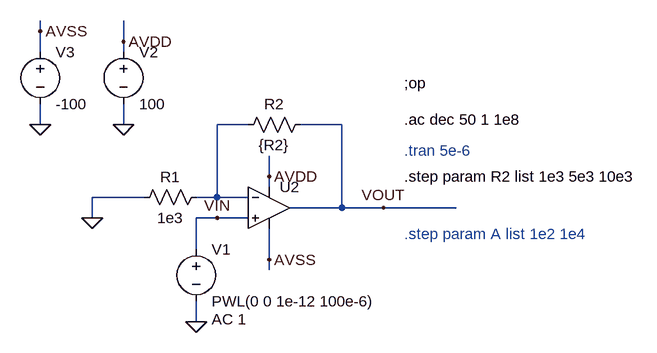
[diagram p0: schematic Opamp1.asc]
Opamp1.asc, the LTspice schematic file:
Version 4
SHEET 1 880 680
WIRE -176 -128 -176 -144
WIRE -48 -112 -48 -144
WIRE -176 -96 -176 -128
WIRE -48 -96 -48 -112
WIRE -176 16 -176 -16
WIRE -48 16 -48 -16
WIRE 144 16 96 16
WIRE 288 16 224 16
WIRE 176 96 176 64
WIRE 176 112 176 96
WIRE -16 128 -96 128
WIRE 96 128 96 16
WIRE 96 128 64 128
WIRE 144 128 96 128
WIRE 288 144 288 16
WIRE 288 144 208 144
WIRE 352 144 288 144
WIRE 464 144 352 144
WIRE -96 160 -96 128
WIRE 96 160 64 160
WIRE 144 160 96 160
WIRE 64 208 64 160
WIRE 176 224 176 176
WIRE 176 240 176 224
WIRE 64 320 64 288
FLAG -48 16 0
FLAG -48 -112 AVDD
FLAG 176 96 AVDD
FLAG -176 16 0
FLAG 176 224 AVSS
FLAG -176 -128 AVSS
FLAG 352 144 VOUT
FLAG -96 160 0
FLAG 64 320 0
FLAG 96 160 VIN
DATAFLAG 176 96 ""
DATAFLAG 80 128 ""
DATAFLAG -64 128 ""
DATAFLAG 256 144 ""
DATAFLAG 176 208 ""
DATAFLAG -176 -128 ""
DATAFLAG -48 -128 ""
SYMBOL OpAmps\\UniversalOpamp2 176 144 R0
SYMATTR InstName U2
SYMATTR Value2 Avol=1e4 GBW=10Meg Slew=10Meg
SYMBOL voltage 64 192 R0
WINDOW 123 24 124 Left 2
WINDOW 39 0 0 Left 0
SYMATTR Value2 AC 1
SYMATTR InstName V1
SYMATTR Value PWL(0 0 1e-12 100e-6)
SYMBOL res 80 112 R90
WINDOW 0 0 56 VBottom 2
WINDOW 3 32 56 VTop 2
SYMATTR InstName R1
SYMATTR Value 1e3
SYMBOL res 240 0 R90
WINDOW 0 0 56 VBottom 2
WINDOW 3 32 56 VTop 2
SYMATTR InstName R2
SYMATTR Value {R2}
SYMBOL voltage -48 -112 R0
WINDOW 123 0 0 Left 0
WINDOW 39 0 0 Left 0
SYMATTR InstName V2
SYMATTR Value 100
SYMBOL voltage -176 -112 R0
WINDOW 123 0 0 Left 0
WINDOW 39 0 0 Left 0
SYMATTR InstName V3
SYMATTR Value -100
TEXT 384 -48 Left 2 !;op
TEXT 384 8 Left 2 !.ac dec 50 1 1e8
TEXT 384 56 Left 2 ;.tran 5e-6
TEXT 384 96 Left 2 !.step param R2 list 1e3 5e3 10e3
TEXT 384 184 Left 2 ;.step param A list 1e2 1e4

The netlist it stands for:
* Opamp1.asc
XU2 VIN N001 AVDD AVSS VOUT level.2 Avol=1e4 GBW=10Meg Slew=10Meg ilimit=25m rail=0 Vos=0 phimargin=45 en=0 enk=0 in=0 ink=0 Rin=500Meg  ; pins IN+ IN- V+ V- OUT
V1 VIN 0 PWL(0 0 1e-12 100e-6) AC 1
R1 N001 0 1e3
R2 VOUT N001 {R2}
V2 AVDD 0 100
V3 AVSS 0 -100
;op
.ac dec 50 1 1e8
* .tran 5e-6
.step param R2 list 1e3 5e3 10e3
* .step param A list 1e2 1e4
.lib UniversalOpamps2.sub
.backanno
.end